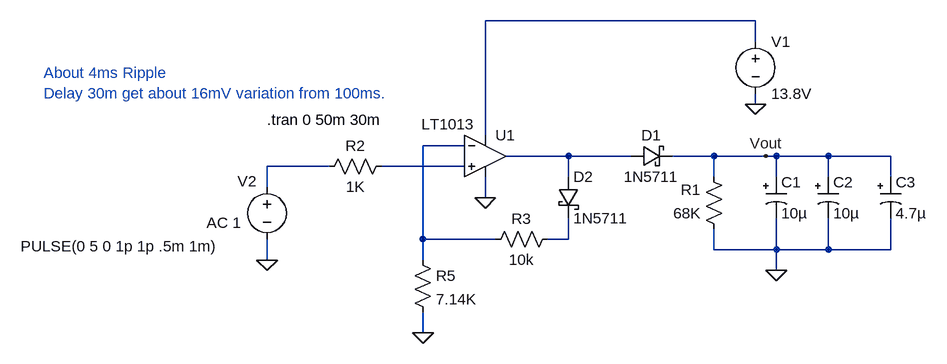
[diagram p0: schematic LM1013 Peak Detector with Gain Test.asc]
LM1013 Peak Detector with Gain Test.asc, the LTspice schematic file:
Version 4
SHEET 1 880 680
WIRE 512 -64 96 -64
WIRE 512 -32 512 -64
WIRE 512 64 512 48
WIRE 96 112 96 -64
WIRE 64 128 0 128
WIRE 224 144 128 144
WIRE 320 144 224 144
WIRE 448 144 384 144
WIRE 528 144 448 144
WIRE 544 144 528 144
WIRE 624 144 544 144
WIRE 720 144 624 144
WIRE -144 160 -240 160
WIRE 64 160 -64 160
WIRE 224 176 224 144
WIRE 448 176 448 144
WIRE 544 176 544 144
WIRE 624 176 624 144
WIRE 720 176 720 144
WIRE -240 192 -240 160
WIRE 96 208 96 176
WIRE 0 272 0 128
WIRE 112 272 0 272
WIRE 224 272 224 240
WIRE 224 272 192 272
WIRE 448 288 448 256
WIRE 544 288 544 240
WIRE 544 288 448 288
WIRE 624 288 624 240
WIRE 624 288 544 288
WIRE 720 288 720 240
WIRE 720 288 624 288
WIRE -240 304 -240 272
WIRE 0 304 0 272
WIRE 544 320 544 288
WIRE 0 416 0 384
FLAG -240 304 0
FLAG 512 64 0
FLAG 96 208 0
FLAG 0 416 0
FLAG 528 144 Vout
FLAG 544 320 0
SYMBOL voltage 512 -48 R0
WINDOW 123 0 0 Left 2
WINDOW 39 0 0 Left 2
SYMATTR InstName V1
SYMATTR Value 13.8V
SYMBOL res -48 144 R90
WINDOW 0 0 56 VBottom 2
WINDOW 3 32 56 VTop 2
SYMATTR InstName R2
SYMATTR Value 1K
SYMBOL voltage -240 176 R0
WINDOW 0 -45 7 Left 2
WINDOW 3 -379 107 Left 2
WINDOW 123 -93 71 Left 2
WINDOW 39 0 0 Left 2
SYMATTR InstName V2
SYMATTR Value PULSE(0 5 0 1p 1p .5m 1m)
SYMATTR Value2 AC 1
SYMBOL Opamps\\LT1013 96 80 R0
WINDOW 3 -98 15 Left 2
SYMATTR InstName U1
SYMBOL res 208 256 R90
WINDOW 0 0 56 VBottom 2
WINDOW 3 32 56 VTop 2
SYMATTR InstName R3
SYMATTR Value 10k
SYMBOL res -16 288 R0
SYMATTR InstName R5
SYMATTR Value 7.14K
SYMBOL schottky 320 160 R270
WINDOW 0 32 32 VTop 2
WINDOW 3 0 32 VBottom 2
SYMATTR InstName D1
SYMATTR Value 1N5711
SYMATTR Description Diode
SYMATTR Type diode
SYMBOL polcap 528 176 R0
WINDOW 3 24 56 Left 2
SYMATTR InstName C1
SYMATTR Value 10µ
SYMATTR Description Capacitor
SYMATTR Type cap
SYMATTR SpiceLine V=100 Irms=385m Rser=0.18 Lser=0
SYMBOL res 464 272 R180
WINDOW 0 36 76 Left 2
WINDOW 3 36 40 Left 2
SYMATTR InstName R1
SYMATTR Value 68K
SYMBOL schottky 208 176 R0
SYMATTR InstName D2
SYMATTR Value 1N5711
SYMATTR Description Diode
SYMATTR Type diode
SYMBOL polcap 608 176 R0
WINDOW 3 24 56 Left 2
SYMATTR InstName C2
SYMATTR Value 10µ
SYMATTR Description Capacitor
SYMATTR Type cap
SYMATTR SpiceLine V=100 Irms=385m Rser=0.18 Lser=0
SYMBOL polcap 704 176 R0
WINDOW 3 24 56 Left 2
SYMATTR InstName C3
SYMATTR Value 4.7µ
SYMATTR Description Capacitor
SYMATTR Type cap
SYMATTR SpiceLine V=100 Irms=385m Rser=0.18 Lser=0
TEXT -240 88 Left 2 !.tran 0 50m 30m
TEXT -584 16 Left 2 ;About 4ms Ripple\nDelay 30m get about 16mV variation from 100ms.

The netlist it stands for:
* LM1013 Peak Detector with Gain Test.asc
V1 N001 0 13.8V
R2 N005 N004 1K
V2 N004 0 PULSE(0 5 0 1p 1p .5m 1m) AC 1
XU1 N005 N002 N001 0 N003 LT1013  ; pins In+ In- V+ V- OUT
R3 N006 N002 10k
R5 N002 0 7.14K
D1 N003 Vout 1N5711
C1 Vout 0 10µ V=100 Irms=385m Rser=0.18 Lser=0
R1 0 Vout 68K
D2 N003 N006 1N5711
C2 Vout 0 10µ V=100 Irms=385m Rser=0.18 Lser=0
C3 Vout 0 4.7µ V=100 Irms=385m Rser=0.18 Lser=0
.model D D
.lib standard.dio
.tran 0 50m 30m
* About 4ms Ripple
* Delay 30m get about 16mV variation from 100ms.
.lib LTC.lib
.backanno
.end